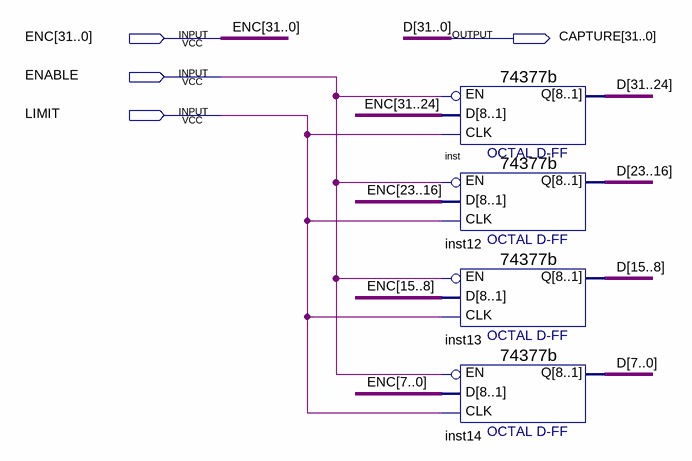
[diagram p0: schematic sheet]
// Quartus schematic limit_capture.bdf as structural Verilog: 4 symbols, 4 pins
module limit_capture (
  input  [31:0] ENC,
  input  ENABLE,
  input  LIMIT,
  output [31:0] CAPTURE
);

  \74377b  inst (.CLK(LIMIT), .EN(ENABLE), .D(ENC[31:24]), .Q(CAPTURE[31:24]));
  \74377b  inst12 (.CLK(LIMIT), .EN(ENABLE), .D(ENC[23:16]), .Q(CAPTURE[23:16]));
  \74377b  inst13 (.CLK(LIMIT), .EN(ENABLE), .D(ENC[15:8]), .Q(CAPTURE[15:8]));
  \74377b  inst14 (.CLK(LIMIT), .EN(ENABLE), .D(ENC[7:0]), .Q(CAPTURE[7:0]));

  // Other names for the same wires on the sheet: D[31:0] = CAPTURE
endmodule
